# EAGLE schematic stepper-driver (EAGLE 4.16)
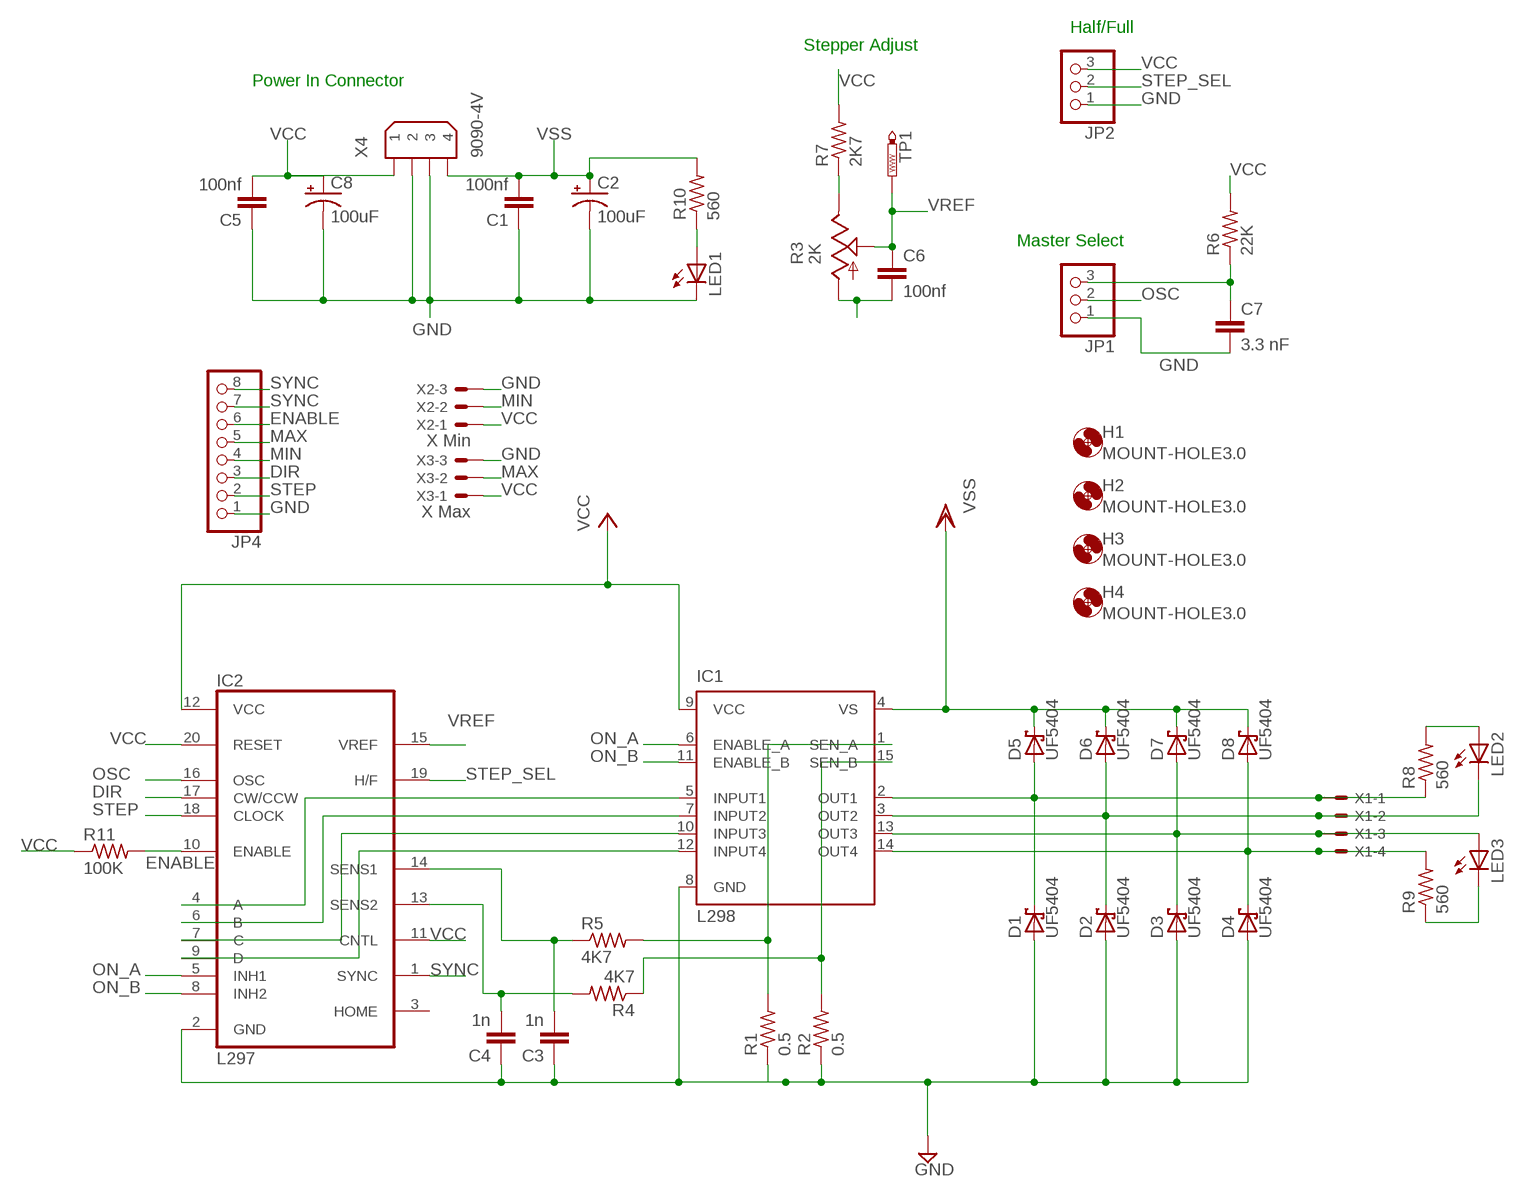
[diagram p0: schematic, sheet 1]

## Parts
C1  100nf  C-EU050-025X075  [C050-025X075]
C2  100uF  CPOL-USE5-6  [E5-6]
C3  1n  C-EU050-030X075  [C050-030X075]
C4  1n  C-EU050-030X075  [C050-030X075]
C5  100nf  C-EU050-025X075  [C050-025X075]
C6  100nf  C-EU050-035X075  [C050-035X075]
C7  3.3 nF  C5/3.5  [C5B3.5]
C8  100uF  CPOL-USE5-6  [E5-6]
D1  UF5404  SCHOTTKY-DIODECB429-15  [CB429-15]
D2  UF5404  SCHOTTKY-DIODECB429-15  [CB429-15]
D3  UF5404  SCHOTTKY-DIODECB429-15  [CB429-15]
D4  UF5404  SCHOTTKY-DIODECB429-15  [CB429-15]
D5  UF5404  SCHOTTKY-DIODECB429-15  [CB429-15]
D6  UF5404  SCHOTTKY-DIODECB429-15  [CB429-15]
D7  UF5404  SCHOTTKY-DIODECB429-15  [CB429-15]
D8  UF5404  SCHOTTKY-DIODECB429-15  [CB429-15]
H1  MOUNT-HOLE3.0  [3,0]
H2  MOUNT-HOLE3.0  [3,0]
H3  MOUNT-HOLE3.0  [3,0]
H4  MOUNT-HOLE3.0  [3,0]
IC1  L298  [MULTIWATT-15]
IC2  L297  [DIL20]
JP1  PINHD-1X3  [1X03]
JP2  PINHD-1X3  [1X03]
JP4  PINHD-1X8  [1X08]
LED1  LED5MM  [LED5MM]
LED2  LED3MM  [LED3MM]
LED3  LED3MM  [LED3MM]
R1  0.5  R-US_0309/12  [0309/12]
R2  0.5  R-US_0309/12  [0309/12]
R3  2K  TRIM_US-B25U  [B25U]
R4  4K7  R-US_0207/7  [0207/7]
R5  4K7  R-US_0207/7  [0207/7]
R6  22K  R-US_0204/7  [0204/7]
R7  2K7  R-US_0207/7  [0207/7]
R8  560  R-US_0207/7  [0207/7]
R9  560  R-US_0207/7  [0207/7]
R10  560  R-US_0207/7  [0207/7]
R11  100K  R-US_0207/7  [0207/7]
TP1  PTR1TP15R  [TP15R]
X1  KK-156-4  [KK-156-4]
X2  X Min  22-23-2031  [22-23-2031]
X3  X Max  22-23-2031  [22-23-2031]
X4  9090-4V  [9090-4V]

## Nets
DIR: IC2.17(CW/CCW) JP4.3
ENABLE: IC2.10(ENABLE) JP4.6 R11.2
GND [Ground]: C1.1 C2.- C3.1 C4.1 C5.1 C6.2 C7.2 C8.- D1.A D2.A D3.A D4.A IC1.8(GND) IC2.2(GND) JP1.1 JP2.1 JP4.1 LED1.K(C) R1.1 R2.1 R3.A X2.3 X3.3 X4.2 X4.3
MAX: JP4.5 X3.2
MIN: JP4.4 X2.2
N$1: R3.E R7.1
N$2: LED3.K(C) R9.1
N$3: LED2.A R8.2
N$4: LED1.A R10.1
N$25: IC1.5(INPUT1) IC2.4(A)
N$26: IC1.7(INPUT2) IC2.6(B)
N$27 [Power]: D4.C D8.A IC1.14(OUT4) R9.2 X1.4
N$28 [Power]: D3.C D7.A IC1.13(OUT3) LED3.A X1.3
N$29 [Power]: D2.C D6.A IC1.3(OUT2) LED2.K(C) X1.2
N$30 [Power]: D1.C D5.A IC1.2(OUT1) R8.1 X1.1
N$31: IC1.10(INPUT3) IC2.7(C)
N$32 [Power]: IC1.15(SEN_B) R2.2 R4.1
N$33 [Power]: IC1.1(SEN_A) R1.2 R5.2
N$34: IC1.12(INPUT4) IC2.9(D)
N$36: C4.2 IC2.13(SENS2) R4.2
N$37: C3.2 IC2.14(SENS1) R5.1
N$41: C7.1 JP1.3 R6.1
ON_A: IC1.6(ENABLE_A) IC2.5(INH1)
ON_B: IC1.11(ENABLE_B) IC2.8(INH2)
OSC: IC2.16(OSC) JP1.2
STEP: IC2.18(CLOCK) JP4.2
STEP_SEL: IC2.19(H/F) JP2.2
SYNC: IC2.1(SYNC) JP4.7 JP4.8
VCC: C5.2 C8.+ IC1.9(VCC) IC2.11(CNTL) IC2.12(VCC) IC2.20(RESET) JP2.3 R6.2 R7.2 R11.1 X2.1 X3.1 X4.1
VREF: C6.1 IC2.15(VREF) R3.S TP1.TP
VSS [Power]: C1.2 C2.+ D5.C D6.C D7.C D8.C IC1.4(VS) R10.2 X4.4
Unconnected: IC2.3(HOME)

## Notes on the sheet
- Half/Full
- Stepper Adjust
- Power In Connector
- Master Select

## Library data of the parts
C1 C3-C6 = rcl:C-EU: CAPACITOR, European symbol
C2 C8 = rcl:CPOL-US: POLARIZED CAPACITOR, American symbol
C7 = capacitor-wima:C: CAPACITOR naming: grid - package width
D1-D8 = diode:SCHOTTKY-DIODE: Schottky Diode
H1-H4 = holes:MOUNT-HOLE: MOUNTING HOLE with drill center marker
IC1 = st-microelectronics:L298: DUAL FULL-BRIDGE DRIVER
IC2 = st-microelectronics:L297: STEPPER MOTOR CONTROLLER
JP1 JP2 = pinhead:PINHD-1X3: PIN HEADER
JP4 = pinhead:PINHD-1X8: PIN HEADER
LED1-LED3 = led:LED: LED OSRAM: - CHIPLED LG R971, LG N971, LY N971, LG Q971, LY Q971, LO R971, LY R971 LH N974, LH R974 LS Q976, LO Q976, LY Q976 LO Q996 - Hyper CHIPLED LW Q18S LB Q993, LB Q99A, LB R99A - SideLED LS A670, LO A670, LY A670, LG A670, LP A670 LB A673, LV A673, LT A673, LW A673 LH A674 LY A675 LS A676, LA A676, LO A676, LY A676, LW A676 LS A679, LY A679, LG A679 - Hyper Micro SIDELED® LS Y876, LA Y876, LO Y876, LY Y876 LT Y87S - SmartLED LW L88C, LW L88S LB L89C, LB L89S, LG L890 LS L89K, LO L89K, LY L89K LS L896, LA L896, LO L896, LY L896 - TOPLED LS T670, LO T670, LY T670, LG T670, LP T670 LSG T670, LSP T670, LSY T670, LOP T670, LYG T670 LG T671, LOG T671, LSG T671 LB T673, LV T673, LT T673, LW T673 LH T674 LS T676, LA T676, LO T676, LY T676, LB T676, LH T676, LSB T676, LW T676 LB T67C, LV T67C, LT T67C, LS T67K, LO T67K, LY T67K, LW E67C LS E67B, LA E67B, LO E67B, LY E67B, LB E67C, LV E67C, LT E67C LW T67C LS T679, LY T679, LG T679 LS T770, LO T770, LY T770, LG T770, LP T770 LB T773, LV T773, LT T773, LW T773 LH T774 LS E675, LA E675, LY E675, LS T675 LS T776, LA T776, LO T776, LY T776, LB T776 LHGB T686 LT T68C, LB T68C - Hyper Mini TOPLED® LB M676 - Mini TOPLED Santana® LG M470 LS M47K, LO M47K, LY M47K Source: http://www.osram.convergy.de - LUMILED® LXK2-PW12-R00, LXK2-PW12-S00, LXK2-PW14-U00, LXK2-PW14-V00 LXK2-PM12-R00, LXK2-PM12-S00, LXK2-PM14-U00 LXK2-PE12-Q00, LXK2-PE12-R00, LXK2-PE12-S00, LXK2-PE14-T00, LXK2-PE14-U00 LXK2-PB12-K00, LXK2-PB12-L00, LXK2-PB12-M00, LXK2-PB14-N00, LXK2-PB14-P00, LXK2-PB14-Q00 LXK2-PR12-L00, LXK2-PR12-M00, LXK2-PR14-Q00, LXK2-PR14-R00 LXK2-PD12-Q00, LXK2-PD12-R00, LXK2-PD12-S00 LXK2-PH12-R00, LXK2-PH12-S00 LXK2-PL12-P00, LXK2-PL12-Q00, LXK2-PL12-R00 Source: www.luxeon.com
R1 R2 R4-R11 = rcl:R-US_: RESISTOR, American symbol
R3 = pot:TRIM_US-: POTENTIOMETER
TP1 = testpad:PTR1: TEST PIN
X1 = con-molex:KK-156-4: KK 156 HEADER Source: http://www.molex.com/pdm_docs/sd/026604100_sd.pdf
X2 X3 = con-molex:22-23-2031: .100" (2.54mm) Center Header - 3 Pin
X4 = con-thomas-betts:9090-4: Disk Drive Power four position Source: Thomas & Betts Electronic Interconnects Eiropean Edition 1998

## Net classes
0 default: width 0.406 mm, drill 0.381 mm
1 Power: width 1.27 mm, drill 0.381 mm
2 Signal: width 0.406 mm, drill 0.381 mm
3 Ground: width 0.406 mm, drill 0.381 mm